# EAGLE schematic Schematic_v3 (EAGLE 9.6.2)
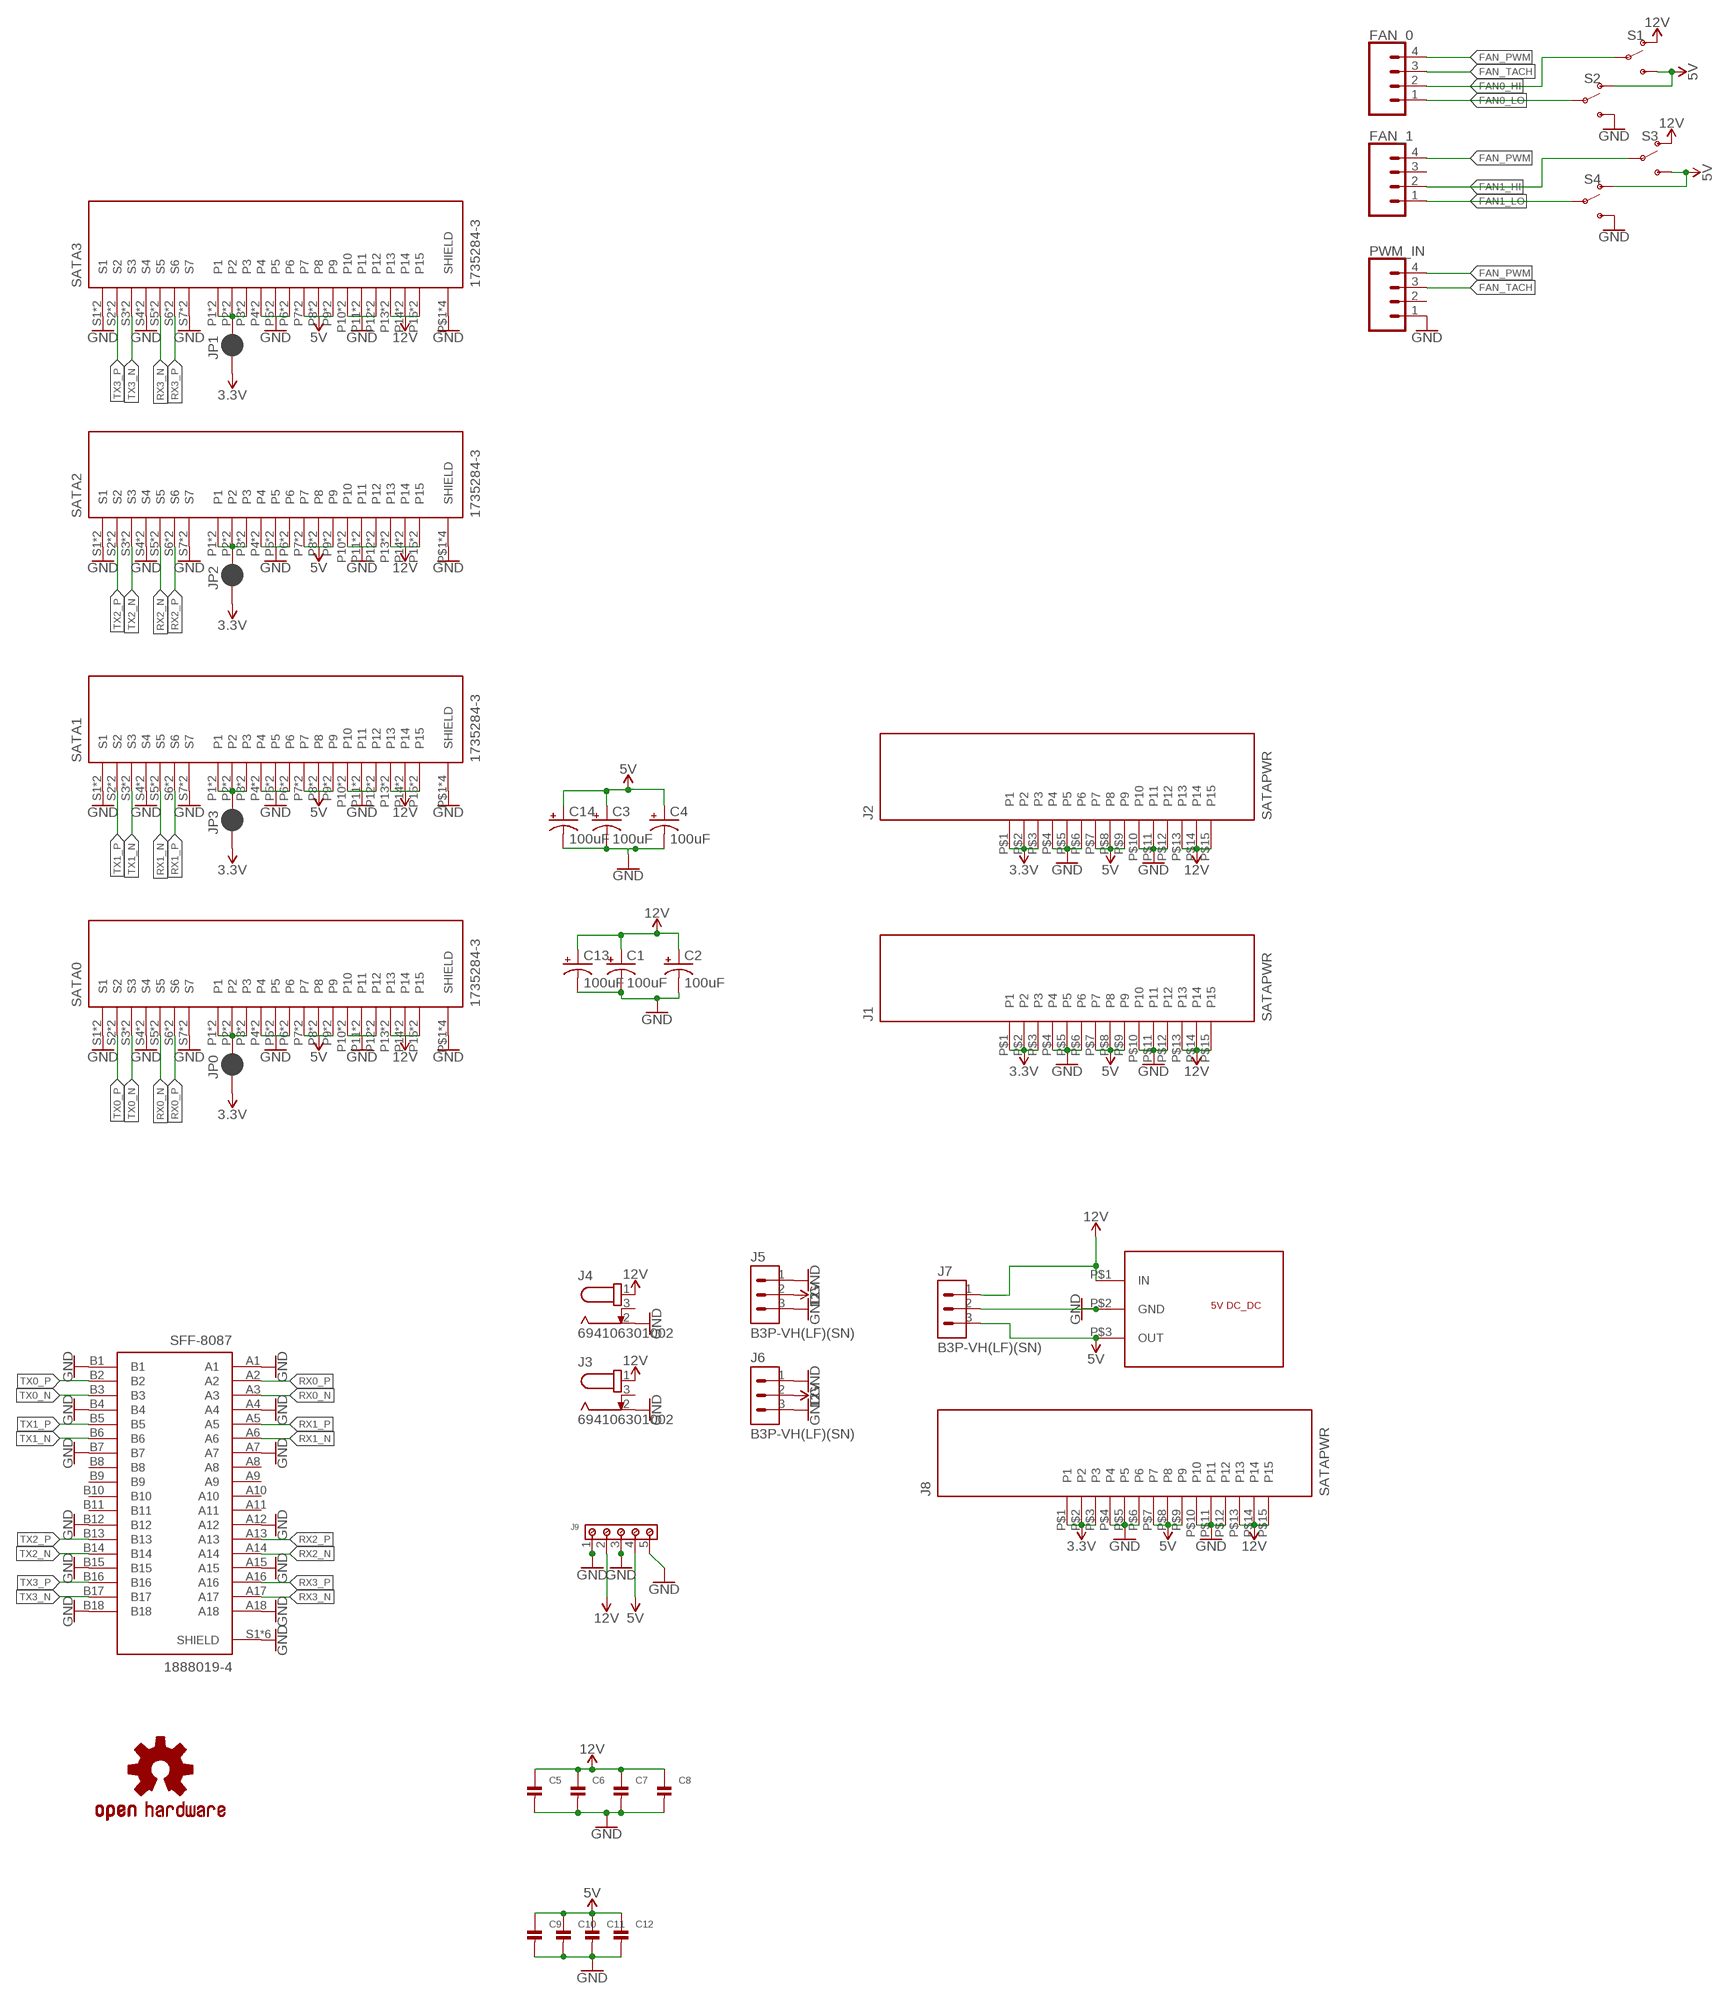
[diagram p0: schematic, sheet 1]

## Parts
C1  100uF  100UF-POLAR-25V-20%(ELEC)  [PANASONIC_D]
C2  100uF  100UF-POLAR-25V-20%(ELEC)  [PANASONIC_D]
C3  100uF  100UF-POLAR-25V-20%(ELEC)  [PANASONIC_D]
C4  100uF  100UF-POLAR-25V-20%(ELEC)  [PANASONIC_D]
C5  CAP_CERAMIC0805  [C0805]
C6  CAP_CERAMIC0805  [C0805]
C7  CAP_CERAMIC0805  [C0805]
C8  CAP_CERAMIC0805  [C0805]
C9  CAP_CERAMIC0805  [C0805]
C10  CAP_CERAMIC0805  [C0805]
C11  CAP_CERAMIC0805  [C0805]
C12  CAP_CERAMIC0805  [C0805]
C13  100uF  100UF-POLAR-25V-20%(ELEC)  [PANASONIC_D]
C14  100uF  100UF-POLAR-25V-20%(ELEC)  [PANASONIC_D]
FAN_0  CONN_04POLAR_LOCK  [MOLEX-1X4_LOCK]
FAN_1  CONN_04POLAR_LOCK  [MOLEX-1X4_LOCK]
J1  SATAPWR  [PTH_90]
J2  SATAPWR  [PTH_90]
J3  694106301002  [694106301002]
J4  694106301002  [694106301002]
J5  B3P-VH(LF)(SN)  [HDR-03]
J6  B3P-VH(LF)(SN)  [HDR-03]
J7  B3P-VH(LF)(SN)  [HDR-03]
J8  SATAPWR  [PTH_90]
J9  691243410005  [691243410005]
JP0  JUMPER-SMT_2_NC_PASTE_SILK  [SMT-JUMPER_2_NC_PASTE_SILK]
JP1  JUMPER-SMT_2_NC_PASTE_SILK  [SMT-JUMPER_2_NC_PASTE_SILK]
JP2  JUMPER-SMT_2_NC_PASTE_SILK  [SMT-JUMPER_2_NC_PASTE_SILK]
JP3  JUMPER-SMT_2_NC_PASTE_SILK  [SMT-JUMPER_2_NC_PASTE_SILK]
LOGO1  OSHW-LOGOL  [OSHW-LOGO-L]
PWM_IN  CONN_04POLAR_LOCK  [MOLEX-1X4_LOCK]
S1  SWITCH-SPDT-PTH-11.6X4.0MM-LOCK  [SWITCH_SPDT_PTH_11.6X4.0MM_LOCK]
S2  SWITCH-SPDT-PTH-11.6X4.0MM-LOCK  [SWITCH_SPDT_PTH_11.6X4.0MM_LOCK]
S3  SWITCH-SPDT-PTH-11.6X4.0MM-LOCK  [SWITCH_SPDT_PTH_11.6X4.0MM_LOCK]
S4  SWITCH-SPDT-PTH-11.6X4.0MM-LOCK  [SWITCH_SPDT_PTH_11.6X4.0MM_LOCK]
SATA0  1735284-3  2023246-21735284-3  [TE_2023246-2]
SATA1  1735284-3  2023246-21735284-3  [TE_2023246-2]
SATA2  1735284-3  2023246-21735284-3  [TE_2023246-2]
SATA3  1735284-3  2023246-21735284-3  [TE_2023246-2]
SFF-8087  1888019-4  [TE_1888019-4]
U$1  5V_DC_DC  [5V_15W_DC_DC]

## Nets
3.3V: J1.P$1(P1) J1.P$2(P2) J1.P$3(P3) J2.P$1(P1) J2.P$2(P2) J2.P$3(P3) J8.P$1(P1) J8.P$2(P2) J8.P$3(P3) JP0.1 JP1.1 JP2.1 JP3.1
5V: C3.+ C4.+ C9.1 C10.1 C11.1 C12.1 C14.+ J1.P$7(P7) J1.P$8(P8) J1.P$9(P9) J2.P$7(P7) J2.P$8(P8) J2.P$9(P9) J7.3 J8.P$7(P7) J8.P$8(P8) J8.P$9(P9) J9.4 S1.3(S) S2.1(O) S3.3(S) S4.1(O) SATA0.P7 SATA0.P8 SATA0.P9 SATA0.THT14(P7) SATA0.THT15(P8) SATA0.THT16(P9) SATA1.P7 SATA1.P8 SATA1.P9 SATA1.THT14(P7) SATA1.THT15(P8) SATA1.THT16(P9) SATA2.P7 SATA2.P8 SATA2.P9 SATA2.THT14(P7) SATA2.THT15(P8) SATA2.THT16(P9) SATA3.P7 SATA3.P8 SATA3.P9 SATA3.THT14(P7) SATA3.THT15(P8) SATA3.THT16(P9) U$1.P$3(OUT)
12V: C1.+ C2.+ C5.1 C6.1 C7.1 C8.1 C13.+ J1.P$13(P13) J1.P$14(P14) J1.P$15(P15) J2.P$13(P13) J2.P$14(P14) J2.P$15(P15) J3.1 J4.1 J5.2 J6.2 J7.1 J8.P$13(P13) J8.P$14(P14) J8.P$15(P15) J9.2 S1.1(O) S3.1(O) SATA0.P13 SATA0.P14 SATA0.P15 SATA0.THT20(P13) SATA0.THT21(P14) SATA0.THT22(P15) SATA1.P13 SATA1.P14 SATA1.P15 SATA1.THT20(P13) SATA1.THT21(P14) SATA1.THT22(P15) SATA2.P13 SATA2.P14 SATA2.P15 SATA2.THT20(P13) SATA2.THT21(P14) SATA2.THT22(P15) SATA3.P13 SATA3.P14 SATA3.P15 SATA3.THT20(P13) SATA3.THT21(P14) SATA3.THT22(P15) U$1.P$1(IN)
FAN0_HI: FAN_0.2 S1.2(P)
FAN0_LO: FAN_0.1 S2.2(P)
FAN1_HI: FAN_1.2 S3.2(P)
FAN1_LO: FAN_1.1 S4.2(P)
FAN_PWM: FAN_0.4 FAN_1.4 PWM_IN.4
FAN_TACH: FAN_0.3 PWM_IN.3
GND: C1.- C2.- C3.- C4.- C5.2 C6.2 C7.2 C8.2 C9.2 C10.2 C11.2 C12.2 C13.- C14.- J1.P$4(P4) J1.P$5(P5) J1.P$6(P6) J1.P$10(P10) J1.P$11(P11) J1.P$12(P12) J2.P$4(P4) J2.P$5(P5) J2.P$6(P6) J2.P$10(P10) J2.P$11(P11) J2.P$12(P12) J3.2 J4.2 J5.1 J5.3 J6.1 J6.3 J7.2 J8.P$4(P4) J8.P$5(P5) J8.P$6(P6) J8.P$10(P10) J8.P$11(P11) J8.P$12(P12) J9.1 J9.3 J9.5 PWM_IN.1 S2.3(S) S4.3(S) SATA0.P4 SATA0.P5 SATA0.P6 SATA0.P10 SATA0.P11 SATA0.P12 SATA0.P$1(SHIELD) SATA0.P$2(SHIELD) SATA0.S1 SATA0.S4 SATA0.S7 SATA0.THT1(S1) SATA0.THT4(S4) SATA0.THT7(S7) SATA0.THT11(P4) SATA0.THT12(P5) SATA0.THT13(P6) SATA0.THT17(P10) SATA0.THT18(P11) SATA0.THT19(P12) SATA0.THT$1(SHIELD) SATA0.THT$2(SHIELD) SATA1.P4 SATA1.P5 SATA1.P6 SATA1.P10 SATA1.P11 SATA1.P12 SATA1.P$1(SHIELD) SATA1.P$2(SHIELD) SATA1.S1 SATA1.S4 SATA1.S7 SATA1.THT1(S1) SATA1.THT4(S4) SATA1.THT7(S7) SATA1.THT11(P4) SATA1.THT12(P5) SATA1.THT13(P6) SATA1.THT17(P10) SATA1.THT18(P11) SATA1.THT19(P12) SATA1.THT$1(SHIELD) SATA1.THT$2(SHIELD) SATA2.P4 SATA2.P5 SATA2.P6 SATA2.P10 SATA2.P11 SATA2.P12 SATA2.P$1(SHIELD) SATA2.P$2(SHIELD) SATA2.S1 SATA2.S4 SATA2.S7 SATA2.THT1(S1) SATA2.THT4(S4) SATA2.THT7(S7) SATA2.THT11(P4) SATA2.THT12(P5) SATA2.THT13(P6) SATA2.THT17(P10) SATA2.THT18(P11) SATA2.THT19(P12) SATA2.THT$1(SHIELD) SATA2.THT$2(SHIELD) SATA3.P4 SATA3.P5 SATA3.P6 SATA3.P10 SATA3.P11 SATA3.P12 SATA3.P$1(SHIELD) SATA3.P$2(SHIELD) SATA3.S1 SATA3.S4 SATA3.S7 SATA3.THT1(S1) SATA3.THT4(S4) SATA3.THT7(S7) SATA3.THT11(P4) SATA3.THT12(P5) SATA3.THT13(P6) SATA3.THT17(P10) SATA3.THT18(P11) SATA3.THT19(P12) SATA3.THT$1(SHIELD) SATA3.THT$2(SHIELD) SFF-8087.A1 SFF-8087.A4 SFF-8087.A7 SFF-8087.A12 SFF-8087.A15 SFF-8087.A18 SFF-8087.B1 SFF-8087.B4 SFF-8087.B7 SFF-8087.B12 SFF-8087.B15 SFF-8087.B18 SFF-8087.S1(SHIELD) SFF-8087.S2(SHIELD) SFF-8087.S3(SHIELD) SFF-8087.S4(SHIELD) SFF-8087.S5(SHIELD) SFF-8087.S6(SHIELD) U$1.P$2(GND)
N$1: JP1.2 SATA3.P1 SATA3.P2 SATA3.P3 SATA3.THT8(P1) SATA3.THT9(P2) SATA3.THT10(P3)
N$2: JP2.2 SATA2.P1 SATA2.P2 SATA2.P3 SATA2.THT8(P1) SATA2.THT9(P2) SATA2.THT10(P3)
N$3: JP3.2 SATA1.P1 SATA1.P2 SATA1.P3 SATA1.THT8(P1) SATA1.THT9(P2) SATA1.THT10(P3)
N$4: JP0.2 SATA0.P1 SATA0.P2 SATA0.P3 SATA0.THT8(P1) SATA0.THT9(P2) SATA0.THT10(P3)
RX0_N [RX0]: SATA0.S5 SATA0.THT5(S5) SFF-8087.A3
RX0_P [RX0]: SATA0.S6 SATA0.THT6(S6) SFF-8087.A2
RX1_N [RX1]: SATA1.S5 SATA1.THT5(S5) SFF-8087.A6
RX1_P [RX1]: SATA1.S6 SATA1.THT6(S6) SFF-8087.A5
RX2_N [RX2]: SATA2.S5 SATA2.THT5(S5) SFF-8087.A14
RX2_P [RX2]: SATA2.S6 SATA2.THT6(S6) SFF-8087.A13
RX3_N [RX3]: SATA3.S5 SATA3.THT5(S5) SFF-8087.A17
RX3_P [RX3]: SATA3.S6 SATA3.THT6(S6) SFF-8087.A16
TX0_N [TX0]: SATA0.S3 SATA0.THT3(S3) SFF-8087.B3
TX0_P [TX0]: SATA0.S2 SATA0.THT2(S2) SFF-8087.B2
TX1_N [TX1]: SATA1.S3 SATA1.THT3(S3) SFF-8087.B6
TX1_P [TX1]: SATA1.S2 SATA1.THT2(S2) SFF-8087.B5
TX2_N [TX2]: SATA2.S3 SATA2.THT3(S3) SFF-8087.B14
TX2_P [TX2]: SATA2.S2 SATA2.THT2(S2) SFF-8087.B13
TX3_N [TX3]: SATA3.S3 SATA3.THT3(S3) SFF-8087.B17
TX3_P [TX3]: SATA3.S2 SATA3.THT2(S2) SFF-8087.B16
Unconnected: FAN_1.3 J3.3 J4.3 PWM_IN.2 SFF-8087.A8 SFF-8087.A9 SFF-8087.A10 SFF-8087.A11 SFF-8087.B8 SFF-8087.B9 SFF-8087.B10 SFF-8087.B11

## Library data of the parts
C1-C4 C13 C14 = SparkFun-Capacitors:100UF-POLAR: 100µF polarized capacitors A capacitor is a passive two-terminal electrical component used to store electrical energy temporarily in an electric field.; PROD_ID: CAP-12547
C5-C12 = LU r11.5:CAP_CERAMIC: Ceramic Capacitors 0402 - 0402 Surface Mount Capacitors 16pF 50V 5% [Digikey: 445-4899-2-ND] 18pF 50V 5% [Digikey: 490-1281-2-ND] 22pF 50V 5% [Digikey: 490-1283-2-ND] 68pF 50V 5% [Digikey: 490-1289-2-ND] 0.1uF 10V 10% [Digikey: 490-1318-2-ND] 1.0uF 6.3V 10% [Digikey: 490-1320-2-ND] 0603 - 0603 Surface Mount Capacitors 16 pF 50V 5% [Digikey: 445-5051-2-ND] 22 pF 50V [Digikey: PCC220ACVTR-ND] 33 pF 50V 5% [Digikey: 490-1415-1-ND] 56pF 50V 5% [Digikey: 490-1421-1-ND] 220pF 50V 5% [Digikey: 445-1285-1-ND] 680 pF 50V 2200 pF 50V 5% C0G [Digikey: 445-1297-1-ND] 5600 pF 100V 5% X7R [Digikey: 478-3711-1-ND] 0.1 µF 25V 10% [Digikey: PCC2277TR-ND] 0.22 µF 16V 10% X7R [Digikey: 445-1318-1-ND] 1.0 µF 25V 10% [Digikey: 445-5146-2-ND] 0603 - RF Specific 3pF 250V +/-0.1pF RF [Digikey: 712-1347-1-ND] 18 pF 250V 5% [Digikey: 478-3505-1-ND or 712-1322-1-ND] 56 pF 250V 5% C0G RF [Digikey: 490-4867-1-ND] 68 pF 250V RF [Digikey: 490-4868-1-ND] 0805 - 0805 Surface Mount Capacitors 220 pF 250V 2% RF Ceramic Capacitor [Digikey: 712-1398-1-ND] 1000 pF 50V 2% NP0 Ceramic Capacitor [Digikey: 478-3760-1-ND] 0.1 µF 25V 10% Ceramic Capacitor [Digikey: PCC1828TR-ND] 1.0 µF 16V 10% Ceramic Capacitor[Digikey: 490-1691-2-ND] 10.0 µF 10V 10% Ceramic Capacitor[Digikey: 709-1228-1-ND] 10.0 uF 16V 10% Ceramic Capacitor [Digikey: 478-5165-2-ND] 47 uF 6.3V 20% Ceramic Capacitor [Digikey: 587-1779-1-ND or 399-5506-1-ND] 1206 - 1206 Surface Mount Capacitors 47uF 10V 20% Ceramic Capacitor [Digikey: 490-5528-1-ND or 399-5508-1-ND or 445-6010-1-ND] 100uF 6.3V -20%, +80% Y5V Ceramic Capacitor (Digikey: 490-4512-1-ND, Mouser: 81-GRM31CF50J107ZE1L)
FAN_0 FAN_1 PWM_IN = SparkFun-Connectors:CONN_04: Multi connection point. Often used as Generic Header-pin footprint for 0.1 inch spaced/style header connections On any of the 0.1 inch spaced packages, you can populate with these: Break Away Headers - Straight <https://www.sparkfun.com/products/116> (PRT-00116) Break Away Male Headers - Right Angle <https://www.sparkfun.com/products/553> (PRT-00553) Female Headers <https://www.sparkfun.com/products/115> (PRT-00115) Break Away Headers - Machine Pin <https://www.sparkfun.com/products/117> (PRT-00117) Break Away Female Headers - Swiss Machine Pin <https://www.sparkfun.com/products/743> (PRT-00743) For SCREWTERMINALS and SPRING TERMINALS visit here: Screw Terimnals on SparkFun.com <https://www.sparkfun.com/search/results?term=Screw+Terminals> (5mm/3.5mm/2.54mm spacing) This device is also useful as a general connection point to wire up your design to another part of your project. Our various solder wires solder well into these plated through hole pads. Hook-Up Wire - Assortment (Stranded, 22 AWG) <https://www.sparkfun.com/products/11375> (PRT-11375) Hook-Up Wire - Assortment (Solid Core, 22 AWG) <https://www.sparkfun.com/products/11367> (PRT-11367) View the entire wire category on our website here <https://www.sparkfun.com/categories/141> Special notes: Molex polarized connector foot print use with SKU : PRT-08231 with associated crimp pins and housings. 1MM SMD Version SKU: PRT-10208; PROD_ID: CONN-08186; SF_ID: PRT-08231
J1 J2 J8 = SATA_Power:SATAPWR: Conn SATA RCP 22 POS 1.27mm Solder RA SMD 22 Terminal 1 Port Tray Check availability <https://pricing.snapeda.com/parts/2023246-2/TE%20Connectivity/view-part?ref=eda>
J3 J4 = DC Power Jacks:694106301002: CONN PWR JACK 2.1X5.5MM SOLDER Manufacturer's datasheet <https://katalog.we-online.de/em/datasheet/6941xx301002.pdf>; CREATED_BY: PCBLayout.com; DIGIKEY_PART_NUMBER: 732-5930-ND; MANUFACTURER: Wurth Electronics Inc.; MPN: 694106301002
J5-J7 = Connectors:B3P-VH(LF)(SN): CONN HEADER VERT 3POS 3.96MM Manufacturer's datasheet <http://www.jst-mfg.com/product/pdf/eng/eVH.pdf>; CREATED_BY: PCBLayout.com; DIGIKEY_PART_NUMBER: 455-1640-ND; MANUFACTURER: JST Sales America Inc.; MPN: B3P-VH(LF)(SN)
J9 = Wurth_Connectors_WR-TBL Rising Cage Clamp:691243410005: WR-TBL Serie 2434 - 7.62 mm Horizontal Entry Modular w. Rising Cage Clamp KIND PROPERTIES Pitch 7.62 mm MATERIAL PROPERTIES Insulator Material PA66 Insulator Flammability Rating UL94 V-0 Contact Material Copper Alloy Contact Plating Tin over Nickel Terminal Screw Material Steel Terminal Screw Plating Zinc Wire Guard Material Copper Alloy GENERAL INFORMATION Operating Temperature -30 up to +120 °C Compliance RoHS ELECTRICAL PROPERTIES IR UL 10 A IR VDE 10 A Working Voltage [UL] 300 V (AC) Working Voltage [VDE] 450 V (AC) Withstanding Voltage [UL] 1600 V (AC) Withstanding Voltage [cULus] 1600 V (AC) Withstanding Voltage [VDE] 2500 V (AC) Contact Resistance [UL] 20 mΩ Contact Resistance [cULus] 20 mΩ Contact Resistance [VDE] 20 mΩ MECHANICAL PROPERTIES Wire Strip Length 6 Screw M2 CERTIFICATION cULus Approval E150931 VDE Approval 40015434 PACKAGING PROPERTIES Packaging Box <https://www.we-online.com/catalog/media/o60871v209%20Family_TBL_7_62_2434_VERTICAL_CABLE_ENTRY_W_RISING_CLAMP_6912434100xx.jpg> Details see: https://www.we-online.com/catalog/en/TBL_7_62_2434_VERTICAL_CABLE_ENTRY_W_RISING_CLAMP_6912434100xx/ Updated by Ella Wu 2019-11-27 2019(C) Wurth Elektronik; IR-UL: 10A; IR-VDE: 10A; PART-NUMBER: 691243410005; PINS: 5; PITCH: 7.62mm; TYPE: Horizontal; WIRE: 12 to 30 (AWG) 3.31 to 0.0509 (mm²); WORKING-VOLTAGE-UL: 300V (AC); WORKING-VOLTAGE-VDE: 450V (AC)
JP0 JP1-JP3 = SparkFun-Jumpers:JUMPER-SMT_2_NC_PASTE: Normally closed solder jumper This jumper has an aperture in the stencil to allow solder paste to bridge the split in the wire so it's normally closed (NC). Wick off the solder to open the connection. Reapply solder to reclose the connection.
LOGO1 = SparkFun-Aesthetics:OSHW-LOGO: Open-Source Hardware (OSHW) Logo This logo indicates the piece of hardware it is found on incorporates a OSHW license and/or adheres to the definition of open source hardware found here: http://freedomdefined.org/OSHW
S1-S4 = SparkFun-Switches:SWITCH-SPDT: Single Pole, Double Throw (SPDT) Switch Single-pole, double-throw (SPDT) switch. Variant Overview SMD-AYZ0202 Surface Mount DPDT Switch <https://www.sparkfun.com/products/597> (COM-00597) Used on e.g. LilyPad Arduino USB - ATmega32U4 Board <https://www.sparkfun.com/products/12049> PTH-11.6X4.0MM SPDT Mini Power Switch <https://www.sparkfun.com/products/102> (COM-00102) Used on e.g. SparkFun Simon Says - Through-Hole Soldering Kit <https://www.sparkfun.com/products/10547> (KIT-10547) PTH-11.6X4.0MM-KIT KIT version of SPDT Mini Power Switch - Simplifies soldering by removing tStop of switch pins - only one side can be soldered. PTH-11.6X4.0MM-LOCK LOCK version of SPDT Mini Power Switch - Offset pins hold switch in place for easier soldering. SMD-RIGHT-ANGLE Surface Mount Right Angle Switch <https://www.sparkfun.com/products/10860> (COM-10860) Used on e.g. SparkFun ESP8266 Thing <https://www.sparkfun.com/products/13231>; PROD_ID: SWCH-08261; SF_SKU: COM-00102
SATA0 SATA1-SATA3 = 2023246-2:2023246-2: Conn SATA RCP 22 POS 1.27mm Solder RA SMD 22 Terminal 1 Port Tray Check availability <https://pricing.snapeda.com/parts/2023246-2/TE%20Connectivity/view-part?ref=eda>; AVAILABILITY: In Stock; COMMENT: 2023246-2; DESCRIPTION: Conn SATA RCP 22 POS 1.27mm Solder RA SMD 22 Terminal 1 Port Tray; MF: TE Connectivity; MP: 2023246-2; PACKAGE: None; PRICE: None; PURCHASE-URL: https://pricing.snapeda.com/search/part/2023246-2/?ref=eda
SFF-8087 = 1888019-4:1888019-4: Receptacle; Shielded; EVERCLEAR Mini-SAS; Internal; RA Combo; 36 Pos.; Dual Key; AVAILABILITY: Unavailable; COMMENT: 1888019-4; DESCRIPTION: Receptacle; Shielded; EVERCLEAR Mini-SAS; Internal; RA Combo; 36 Pos.; Dual Key; MF: TE Connectivity; MP: 1888019-4; PACKAGE: None; PRICE: None; TE_PURCHASE_URL: https://www.te.com/usa-en/product-1888019-4.html?te_bu=Cor&te_type=disp&te_campaign=seda_glo_cor-seda-global-disp-prtnr-fy19-seda-model-bom-cta_sma-317_1&elqCampaignId=32493
U$1 = SATA_Power_(v2~recovered):5V_DC_DC